# EAGLE schematic ATtiny84 Base Schematic v2 (EAGLE 9.7.0)
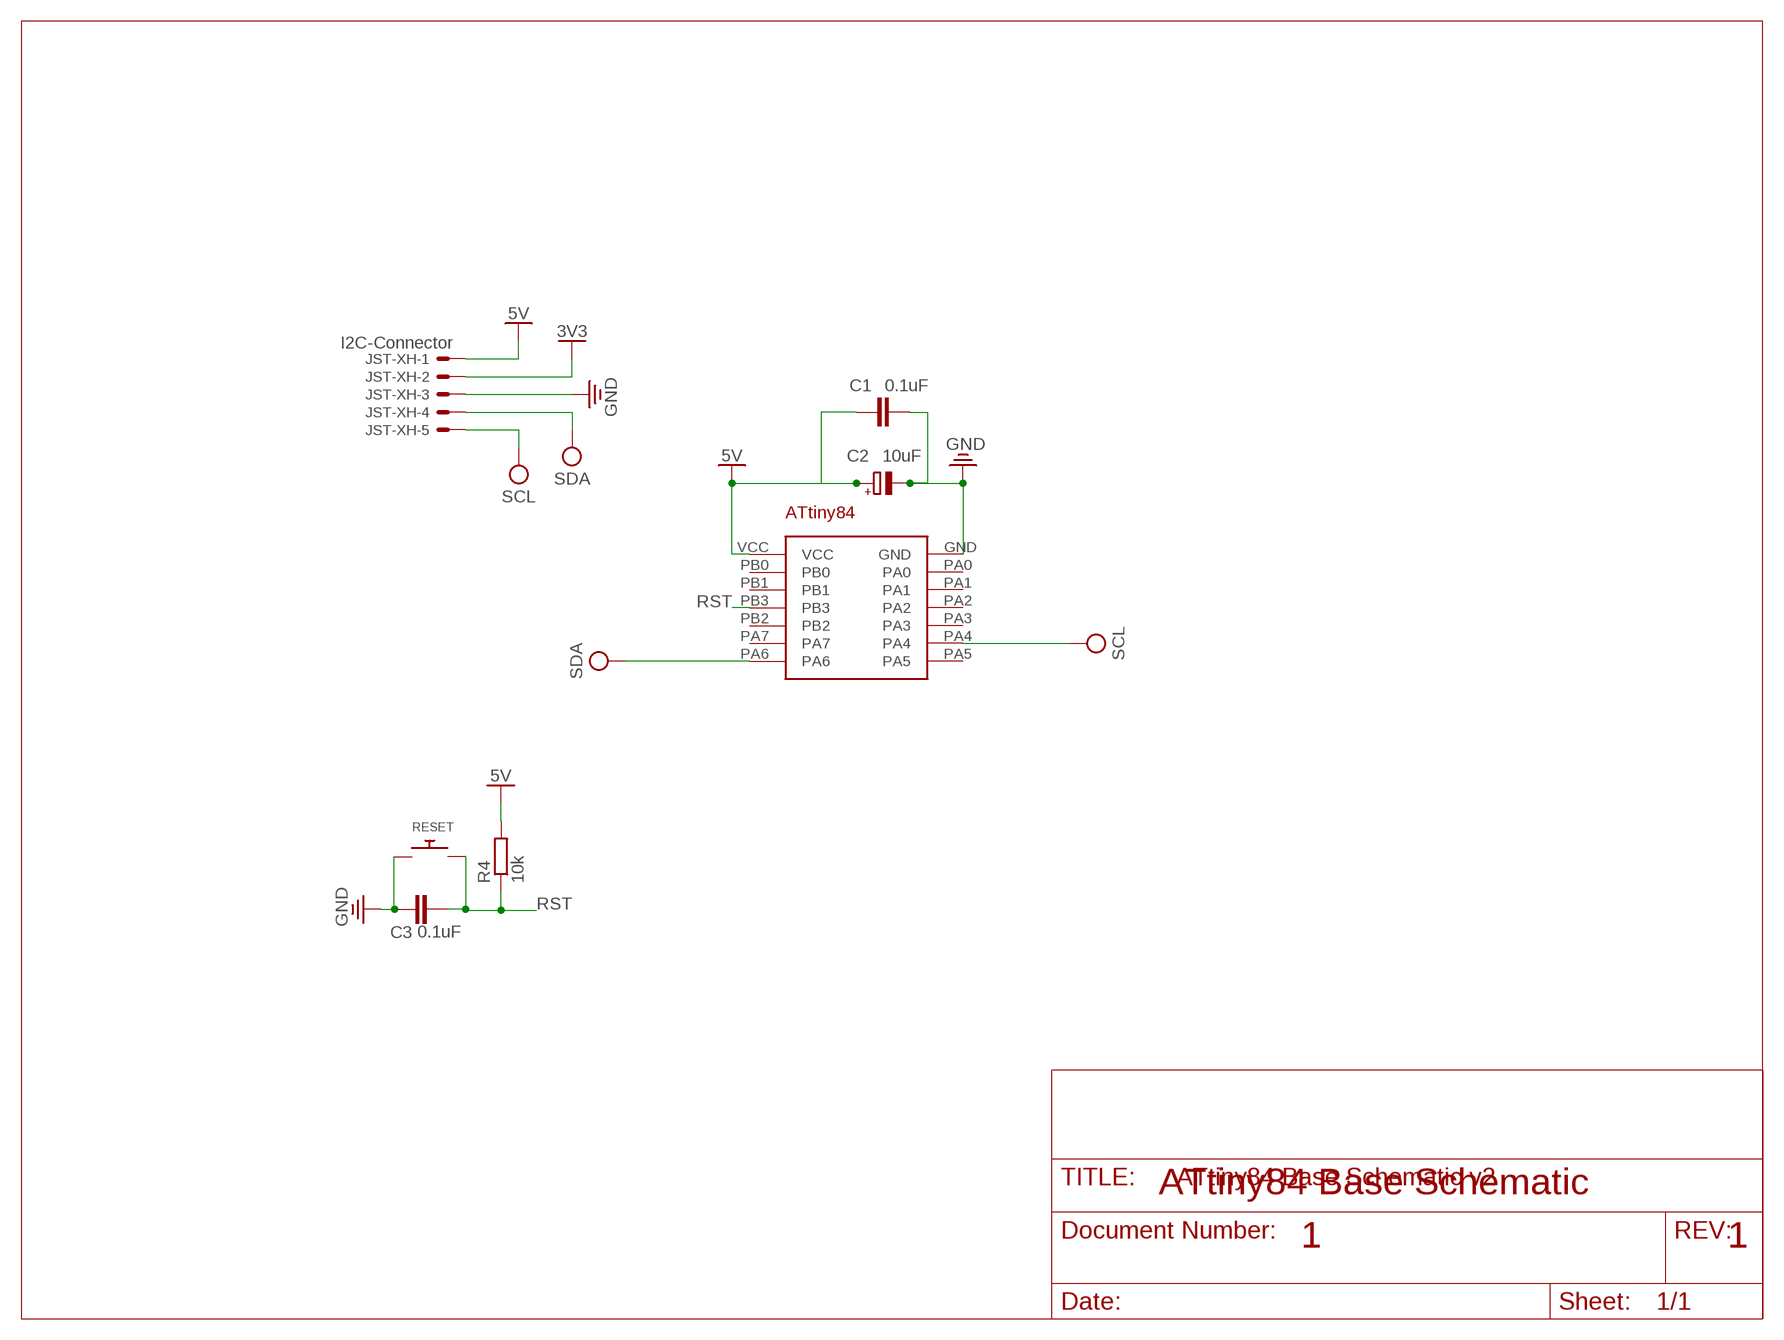
[diagram p0: schematic, sheet 1]

## Parts
C1  0.1uF  C-EU025-025X050  [C025-025X050]
C2  10uF  CPOL-EUE5-10.5  [E5-10,5]
C3  0.1uF  C-EU025-030X050  [C025-030X050]
JST-XH  I2C-Connector  JST-XH-05-PIN-LONG-PAD  [JST-XH-05-PACKAGE-LONG-PAD]
R4  10k  R-EU_0204/7  [0204/7]
RESET  SWITCH_PUSHBUTTONEVQ-PE  [TACT_PANA-EVQ]
U$1  ATTINY84DIP  [ATTINY84(DIP)]

## Nets
3V3: JST-XH.2
5V: C1.1 C2.+ JST-XH.1 R4.2 U$1.VCC
GND: C1.2 C2.- C3.1 JST-XH.3 RESET.P$1 U$1.GND
RST: C3.2 R4.1 RESET.P$2 U$1.PB3
SCL: JST-XH.5 U$1.PA4
SDA: JST-XH.4 U$1.PA6
Unconnected: U$1.PA0 U$1.PA1 U$1.PA2 U$1.PA3 U$1.PA5 U$1.PA7 U$1.PB0 U$1.PB1 U$1.PB2

## Notes on the sheet
- ATtiny84 Base Schematic
- 1 | 1

## Library data of the parts
C1 C3 = rcl:C-EU: CAPACITOR, European symbol; SPICEPREFIX: C
C2 = rcl:CPOL-EU: POLARIZED CAPACITOR, European symbol; SPICEPREFIX: C
JST-XH = Rembrandt Electronics - JST XH Connectors v1-0:JST-XH-05-PIN: JST XH Connector 2 Pin Wire to board connector. Pitch: 2,54 mm, (0.100") Number of pins: 5 Created by Rembrandt Electronics www.rembrandtelectronics.com
R4 = rcl:R-EU_: RESISTOR, European symbol; SPICEPREFIX: R
RESET = adafruit:SWITCH_PUSHBUTTON: Buttons SOFTTOUCHSMD_SJ - Soft touch temporary push button (Super Junk Akihabara) Compatible with SKPMANE010 [Mouser: 688-SKPMAN] C&K_KSS = Digikey: KSS221GLFS
U$1 = RobotMower_Eagle_Library:ATTINY84